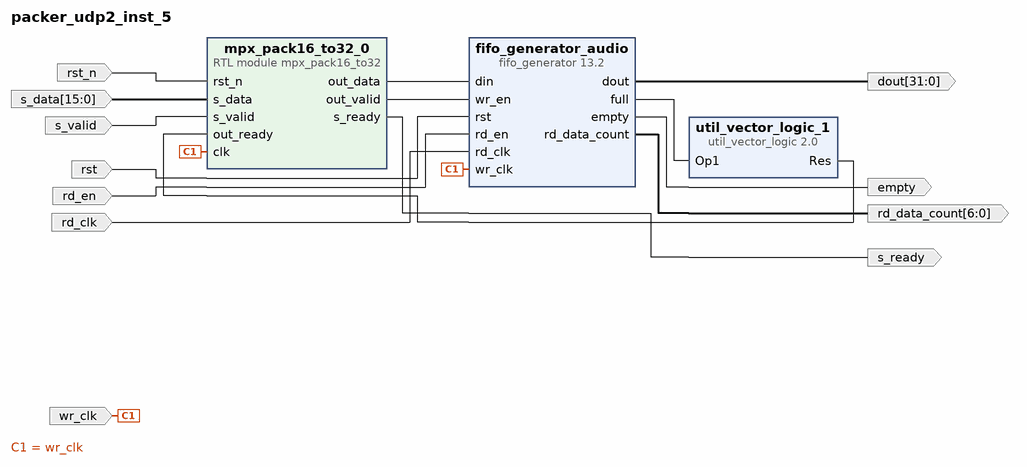
[diagram p0: block diagram of the top level]
# Vivado block design packer_udp2_inst_5, xc7z020clg400-2, Vivado 2023.2
create_bd_design packer_udp2_inst_5

create_bd_port -dir O -from 31 -to 0 dout
create_bd_port -dir O empty
create_bd_port -dir I -type clk rd_clk
create_bd_port -dir O -from 6 -to 0 rd_data_count
create_bd_port -dir I rd_en
create_bd_port -dir I rst
create_bd_port -dir I -type rst rst_n
create_bd_port -dir I -from 15 -to 0 s_data
create_bd_port -dir O s_ready
create_bd_port -dir I s_valid
create_bd_port -dir I -type clk wr_clk

create_bd_cell -type ip -vlnv xilinx.com:ip:fifo_generator:13.2 fifo_generator_audio
set_property -dict [list \
  CONFIG.Enable_Safety_Circuit true \
  CONFIG.Fifo_Implementation Independent_Clocks_Block_RAM \
  CONFIG.Input_Data_Width 32 \
  CONFIG.Input_Depth 128 \
  CONFIG.Performance_Options Standard_FIFO \
  CONFIG.Read_Data_Count true \
] [get_bd_cells fifo_generator_audio]
create_bd_cell -type module -reference mpx_pack16_to32 mpx_pack16_to32_0
create_bd_cell -type ip -vlnv xilinx.com:ip:util_vector_logic:2.0 util_vector_logic_1
set_property -dict {CONFIG.C_OPERATION not CONFIG.C_SIZE 1} [get_bd_cells util_vector_logic_1]

# ---- connections ----

connect_bd_net -net adc_dci_0_1 [get_bd_ports wr_clk] [get_bd_pins fifo_generator_audio/wr_clk] [get_bd_pins mpx_pack16_to32_0/clk]
connect_bd_net -net clk_wiz_0_locked [get_bd_ports rst_n] [get_bd_pins mpx_pack16_to32_0/rst_n]
connect_bd_net [get_bd_pins fifo_generator_audio/dout] [get_bd_ports dout]
connect_bd_net [get_bd_pins fifo_generator_audio/empty] [get_bd_ports empty]
connect_bd_net [get_bd_pins fifo_generator_audio/full] [get_bd_pins util_vector_logic_1/Op1]
connect_bd_net [get_bd_pins fifo_generator_audio/rd_data_count] [get_bd_ports rd_data_count]
connect_bd_net -net fm_demod_m_axis_tdata [get_bd_ports s_data] [get_bd_pins mpx_pack16_to32_0/s_data]
connect_bd_net -net fm_demod_m_axis_tvalid [get_bd_ports s_valid] [get_bd_pins mpx_pack16_to32_0/s_valid]
connect_bd_net [get_bd_pins mpx_pack16_to32_0/out_data] [get_bd_pins fifo_generator_audio/din]
connect_bd_net [get_bd_pins mpx_pack16_to32_0/out_valid] [get_bd_pins fifo_generator_audio/wr_en]
connect_bd_net -net packer_for_udp_Res1 [get_bd_ports rst] [get_bd_pins fifo_generator_audio/rst]
connect_bd_net -net packer_for_udp_audio_rd_en [get_bd_ports rd_en] [get_bd_pins fifo_generator_audio/rd_en]
connect_bd_net -net packer_for_udp_gmii_rxc [get_bd_ports rd_clk] [get_bd_pins fifo_generator_audio/rd_clk]
connect_bd_net -net packer_for_udp_mpx_ready [get_bd_pins mpx_pack16_to32_0/s_ready] [get_bd_ports s_ready]
connect_bd_net [get_bd_pins util_vector_logic_1/Res] [get_bd_pins mpx_pack16_to32_0/out_ready]

validate_bd_design
save_bd_design
